# EAGLE design 8channelrelaydriver_throughole (EAGLE 7.2.0)
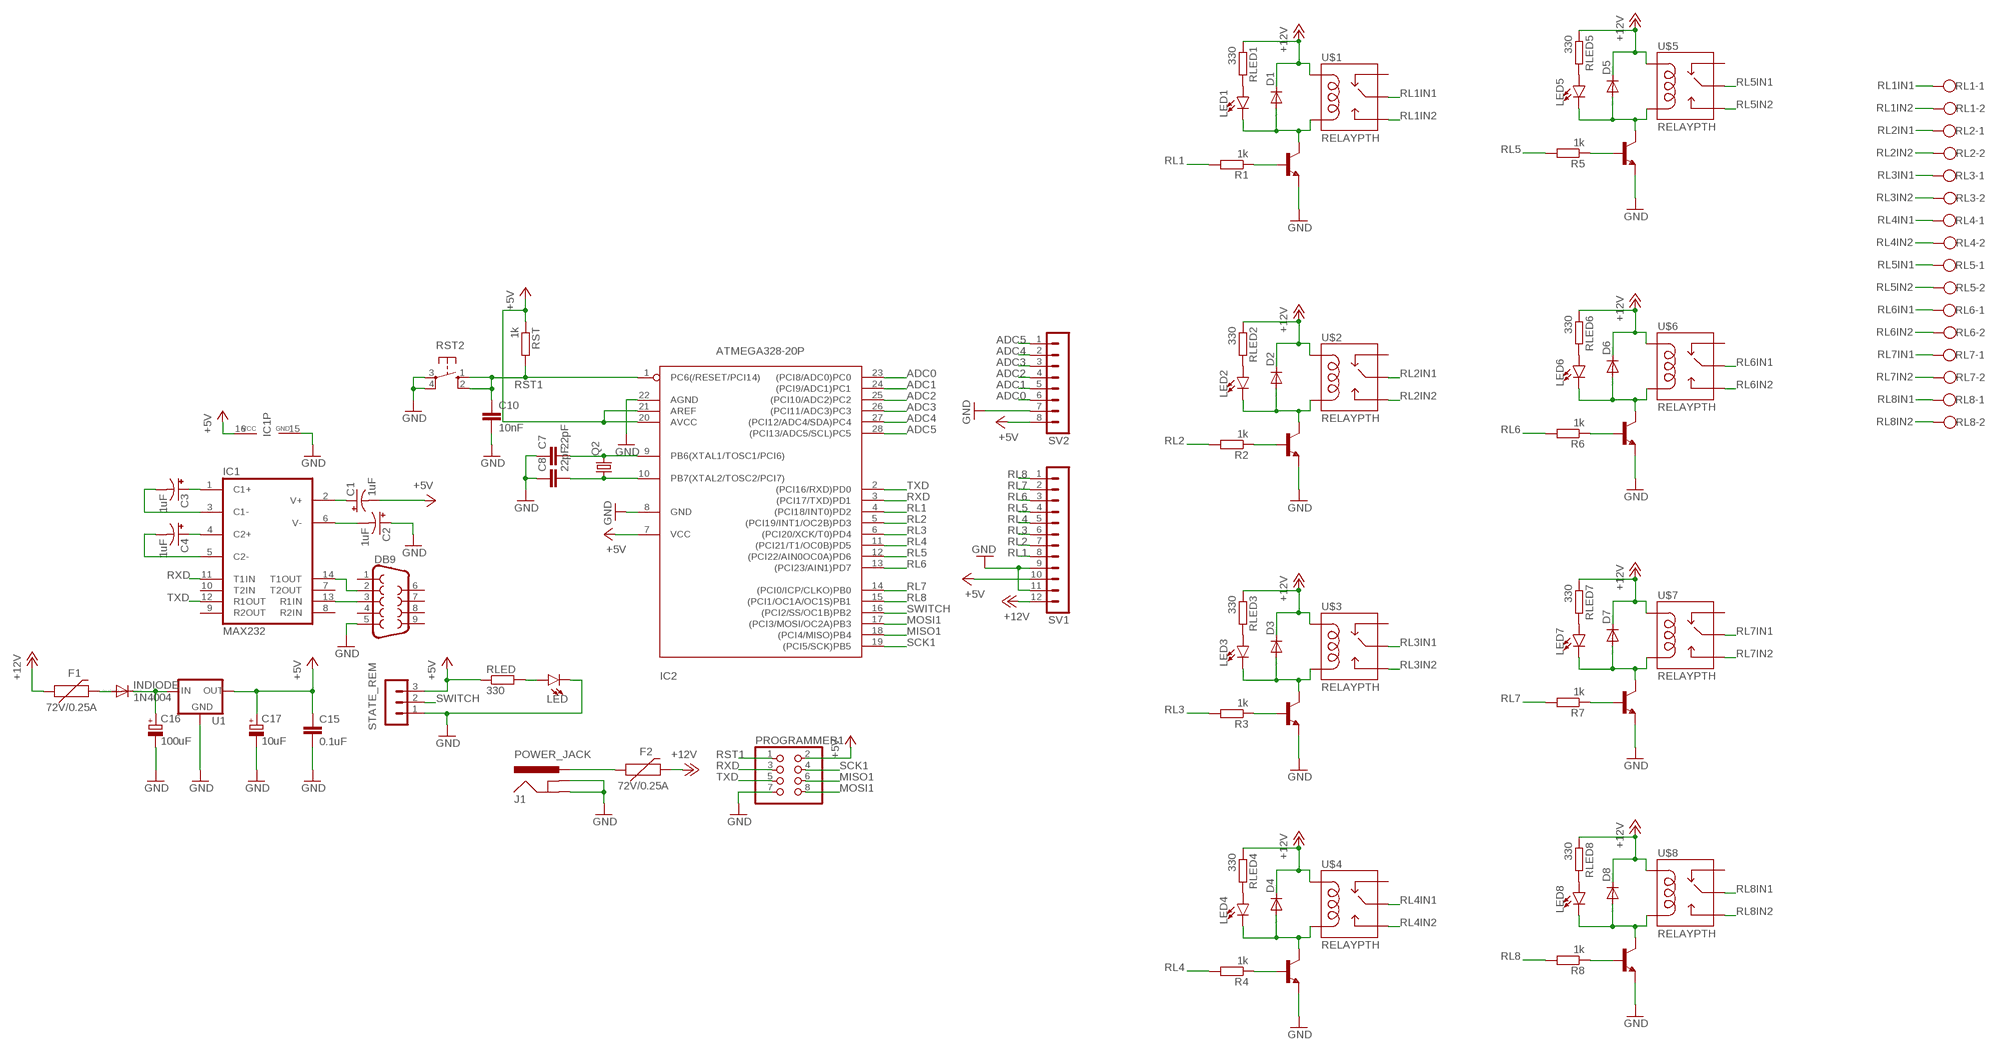
[diagram p0: schematic, sheet 1]

## Parts
C1  1uF  CPOL-USE2.5-6  [E2,5-6]
C2  1uF  CPOL-USE2.5-6  [E2,5-6]
C3  1uF  CPOL-USE2.5-6  [E2,5-6]
C4  1uF  CPOL-USE2.5-6  [E2,5-6]
C7  22pF  C-EU025-025X050  [C025-025X050]
C8  22pF  C-EU025-025X050  [C025-025X050]
C10  10nF  C-EU050-025X075  [C050-025X075]
C15  0.1uF  C-EU050-025X075  [C050-025X075]
C16  100uF  CPOL-EUE2.5-6  [E2,5-6]
C17  10uF  CPOL-EUE2.5-6  [E2,5-6]
D1  1N4004  [DO41-10]
D2  1N4004  [DO41-10]
D3  1N4004  [DO41-10]
D4  1N4004  [DO41-10]
D5  1N4004  [DO41-10]
D6  1N4004  [DO41-10]
D7  1N4004  [DO41-10]
D8  1N4004  [DO41-10]
DB9  DB9FEMALE  [DB9]
F1  72V/0.25A  PPTC_PTH  [PTH]
F2  72V/0.25A  PPTC_PTH  [PTH]
IC1  MAX232  [DIL16]
IC2  ATMEGA328-20P  [DIL28-3]
INDIODE  1N4004  [DO41-10]
J1  POWER_JACK  [POWER_JACK_PTH]
LED  LED5MM  [LED_5MM]
LED1  LED5MM  [LED_5MM]
LED2  LED5MM  [LED_5MM]
LED3  LED5MM  [LED_5MM]
LED4  LED5MM  [LED_5MM]
LED5  LED5MM  [LED_5MM]
LED6  LED5MM  [LED_5MM]
LED7  LED5MM  [LED_5MM]
LED8  LED5MM  [LED_5MM]
PROGRAMMER1  PINHD-2X4  [2X04]
Q2  CRYSTALHC49U70  [HC49U70]
R1  1k  R-EU_0207/10  [0207/10]
R2  1k  R-EU_0207/10  [0207/10]
R3  1k  R-EU_0207/10  [0207/10]
R4  1k  R-EU_0207/10  [0207/10]
R5  1k  R-EU_0207/10  [0207/10]
R6  1k  R-EU_0207/10  [0207/10]
R7  1k  R-EU_0207/10  [0207/10]
R8  1k  R-EU_0207/10  [0207/10]
RL1  W237-102  [W237-102]
RL2  W237-102  [W237-102]
RL3  W237-102  [W237-102]
RL4  W237-102  [W237-102]
RL5  W237-102  [W237-102]
RL6  W237-102  [W237-102]
RL7  W237-102  [W237-102]
RL8  W237-102  [W237-102]
RLED  330  R-EU_0207/10  [0207/10]
RLED1  330  R-EU_0207/10  [0207/10]
RLED2  330  R-EU_0207/10  [0207/10]
RLED3  330  R-EU_0207/10  [0207/10]
RLED4  330  R-EU_0207/10  [0207/10]
RLED5  330  R-EU_0207/10  [0207/10]
RLED6  330  R-EU_0207/10  [0207/10]
RLED7  330  R-EU_0207/10  [0207/10]
RLED8  330  R-EU_0207/10  [0207/10]
RST  1k  R-EU_0207/10  [0207/10]
RST2  10-XX  [B3F-10XX]
STATE_REM  MA03-1  [MA03-1]
SV1  MA12-1  [MA12-1]
SV2  MA08-1  [MA08-1]
T1  BC547  [TO92]
T2  BC547  [TO92]
T3  BC547  [TO92]
T4  BC547  [TO92]
T5  BC547  [TO92]
T6  BC547  [TO92]
T7  BC547  [TO92]
T8  BC547  [TO92]
U1  V_REG_78XXSIDE  [78XXL]
U$1  RELAYPTH  [SRD-05VDC-SL-C]
U$2  RELAYPTH  [SRD-05VDC-SL-C]
U$3  RELAYPTH  [SRD-05VDC-SL-C]
U$4  RELAYPTH  [SRD-05VDC-SL-C]
U$5  RELAYPTH  [SRD-05VDC-SL-C]
U$6  RELAYPTH  [SRD-05VDC-SL-C]
U$7  RELAYPTH  [SRD-05VDC-SL-C]
U$8  RELAYPTH  [SRD-05VDC-SL-C]

## Nets
+12V: D1.C D2.C D3.C D4.C D5.C D6.C D7.C D8.C F1.P$1 F2.P$2 RLED1.1 RLED2.1 RLED3.1 RLED4.1 RLED5.1 RLED6.1 RLED7.1 RLED8.1 SV1.12 U$1.COIL1 U$2.COIL1 U$3.COIL1 U$4.COIL1 U$5.COIL1 U$6.COIL1 U$7.COIL1 U$8.COIL1
ADC0: IC2.23((PCI8/ADC0)PC0) SV2.6
ADC1: IC2.24((PCI9/ADC1)PC1) SV2.5
ADC2: IC2.25((PCI10/ADC2)PC2) SV2.4
ADC3: IC2.26((PCI11/ADC3)PC3) SV2.3
ADC4: IC2.27((PCI12/ADC4/SDA)PC4) SV2.2
ADC5: IC2.28((PCI13/ADC5/SCL)PC5) SV2.1
MISO1: IC2.18((PCI4/MISO)PB4) PROGRAMMER1.6
MOSI1: IC2.17((PCI3/MOSI/OC2A)PB3) PROGRAMMER1.8
N$1: DB9.2 IC1.14(T1OUT)
N$2: LED.A RLED.2
N$3: C16.+ INDIODE.C U1.IN
N$4: D2.A LED2.K(C) T2.3(C) U$2.COIL0
N$5: D1.A LED1.K(C) T1.3(C) U$1.COIL0
N$6: R1.1 T1.2(B)
N$7: R2.1 T2.2(B)
N$8: D3.A LED3.K(C) T3.3(C) U$3.COIL0
N$9: R3.1 T3.2(B)
N$10: D4.A LED4.K(C) T4.3(C) U$4.COIL0
N$11: R4.1 T4.2(B)
N$12: D5.A LED5.K(C) T5.3(C) U$5.COIL0
N$13: R5.1 T5.2(B)
N$14: D6.A LED6.K(C) T6.3(C) U$6.COIL0
N$15: R6.1 T6.2(B)
N$16: D7.A LED7.K(C) T7.3(C) U$7.COIL0
N$17: R7.1 T7.2(B)
N$18: C1.+ IC1.2(V+)
N$19: D8.A LED8.K(C) T8.3(C) U$8.COIL0
N$20: C2.- IC1.6(V-)
N$21: C7.2 IC2.9(PB6(XTAL1/TOSC1/PCI6)) Q2.2
N$22: C8.2 IC2.10(PB7(XTAL2/TOSC2/PCI7)) Q2.1
N$23: C3.+ IC1.1(C1+)
N$24: C4.+ IC1.4(C2+)
N$25: C4.- IC1.5(C2-)
N$26: C3.- IC1.3(C1-)
N$27: R8.1 T8.2(B)
N$28: F1.P$2 INDIODE.A
N$29: LED1.A RLED1.2
N$30: F2.P$1 J1.PWR
N$32: LED2.A RLED2.2
N$34: LED3.A RLED3.2
N$36: LED4.A RLED4.2
N$38: LED5.A RLED5.2
N$40: LED6.A RLED6.2
N$42: LED7.A RLED7.2
N$44: LED8.A RLED8.2
PIN13: DB9.3 IC1.13(R1IN)
RL1: IC2.4((PCI18/INT0)PD2) R1.2 SV1.8
RL1IN1: RL1.1 U$1.SWCOMMON
RL1IN2: RL1.2 U$1.SWOPEN
RL2: IC2.5((PCI19/INT1/OC2B)PD3) R2.2 SV1.7
RL2IN1: RL2.1 U$2.SWCOMMON
RL2IN2: RL2.2 U$2.SWOPEN
RL3: IC2.6((PCI20/XCK/T0)PD4) R3.2 SV1.6
RL3IN1: RL3.1 U$3.SWCOMMON
RL3IN2: RL3.2 U$3.SWOPEN
RL4: IC2.11((PCI21/T1/OC0B)PD5) R4.2 SV1.5
RL4IN1: RL4.1 U$4.SWCOMMON
RL4IN2: RL4.2 U$4.SWOPEN
RL5: IC2.12((PCI22/AIN0OC0A)PD6) R5.2 SV1.4
RL5IN1: RL5.1 U$5.SWCOMMON
RL5IN2: RL5.2 U$5.SWOPEN
RL6: IC2.13((PCI23/AIN1)PD7) R6.2 SV1.3
RL6IN1: RL6.1 U$6.SWCOMMON
RL6IN2: RL6.2 U$6.SWOPEN
RL7: IC2.14((PCI0/ICP/CLKO)PB0) R7.2 SV1.2
RL7IN1: RL7.1 U$7.SWCOMMON
RL7IN2: RL7.2 U$7.SWOPEN
RL8: IC2.15((PCI1/OC1A/OC1S)PB1) R8.2 SV1.1
RL8IN1: RL8.1 U$8.SWCOMMON
RL8IN2: RL8.2 U$8.SWOPEN
RST1: C10.1 IC2.1(PC6(/RESET/PCI14)) PROGRAMMER1.1 RST2.1(S) RST2.2(S1) RST.2
RXD: IC1.11(T1IN) IC2.3((PCI17/TXD)PD1) PROGRAMMER1.3
SCK1: IC2.19((PCI5/SCK)PB5) PROGRAMMER1.4
SWITCH: IC2.16((PCI2/SS/OC1B)PB2) STATE_REM.2
TXD: IC1.12(R1OUT) IC2.2((PCI16/RXD)PD0) PROGRAMMER1.5
VDD: C1.- C15.1 C17.+ IC1.16(VCC) IC2.7(VCC) IC2.20(AVCC) IC2.21(AREF) PROGRAMMER1.2 RLED.1 RST.1 STATE_REM.3 SV1.10 SV2.8 U1.OUT ; supply symbol labelled +5V
VSS: C2.+ C7.1 C8.1 C10.2 C15.2 C16.- C17.- DB9.5 IC1.15(GND) IC2.8(GND) IC2.22(AGND) J1.GND J1.GNDBREAK LED.K(C) PROGRAMMER1.7 RST2.3(P) RST2.4(P1) STATE_REM.1 SV1.9 SV1.11 SV2.7 T1.1(E) T2.1(E) T3.1(E) T4.1(E) T5.1(E) T6.1(E) T7.1(E) T8.1(E) U1.GND ; supply symbol labelled GND
Unconnected: DB9.1 DB9.4 DB9.6 DB9.7 DB9.8 DB9.9 IC1.7(T2OUT) IC1.8(R2IN) IC1.9(R2OUT) IC1.10(T2IN) U$1.SWCLOSED(SWCLOSE) U$2.SWCLOSED(SWCLOSE) U$3.SWCLOSED(SWCLOSE) U$4.SWCLOSED(SWCLOSE) U$5.SWCLOSED(SWCLOSE) U$6.SWCLOSED(SWCLOSE) U$7.SWCLOSED(SWCLOSE) U$8.SWCLOSED(SWCLOSE)

## Library data of the parts
C1-C4 = rcl:CPOL-US: POLARIZED CAPACITOR, American symbol
C7 C8 C10 C15 = rcl:C-EU: CAPACITOR, European symbol
C16 C17 = rcl:CPOL-EU: POLARIZED CAPACITOR, European symbol
D1-D8 INDIODE = diode:1N4004: DIODE general purpose rectifier, 1 A
DB9 = SparkFun-Connectors:DB9: DB9 Connector Standard DB9 (D-Sub 9) serial connector. Can be used for CAN bus as well as RS485 and RS232. Footprint production proven. Here is the female version connector we sell at SparkFun: 9 Pin Female Serial Connector - PCB Mount <https://www.sparkfun.com/products/429> (PRT-00429) This connector has been used on the following SparkFun products: SparkFun RS232 Shifter - SMD <https://www.sparkfun.com/products/449> (PRT-00449) SparkFun RS232 Shifter SMD (No DB9) <https://www.sparkfun.com/products/8780> (PRT-08780); PROD_ID: CONN-08194
F1 F2 = SparkFun-Fuses:PPTC: Resettable Fuse PPTC Resettable Fuse. Really a sort of resistor with a polymeric positive temperature coefficient whose resistance increases dramatically with an increase in temperature. When heated by the power passing through the resistance rises causing the current to be limited, protecting the circuit. This is achieved by the transition of the polymer from a crystalline to an amorphous state where the conductive carbon separates breaking the conductive pathways found in the cool crystalline structure. When a PPTC cools back down it resumes conducting letting the circuit turn back on. SparkFun Products: SparkFun RedBoard - Programmed with Arduino <https://www.sparkfun.com/products/12757> Pro Micro - 5V/16MHz <https://www.sparkfun.com/products/12640> Arduino Pro 328 - 5V/16MHz <https://www.sparkfun.com/products/10915> MP3 Trigger <https://www.sparkfun.com/products/13720>; PROD_ID: RES-08490
IC1 = maxim:MAX232: RS232 TRANSCEIVER; MF: MAXIM; MPN: MAX232ACPE+; OC_FARNELL: 9723773; OC_NEWARK: 68K4544
IC2 = atmega328:ATMEGA328*P: MICROCONTROLLER 32 kBytes FLASH 2 kBytes SRAM 1 kBytes EEPROM USART 8-channel 10 bit ADC
J1 = SparkFun-Connectors:POWER_JACK: Power Jack Connector This is the standard 5.5mm barrel jack for power. The PTH is the most common, proven, reliable, footprint. The Slot footprint only works if the mill layer is transmitted to the PCB fab house so be warned. Here are the connectors we sell at SparkFun: DC Barrel Power Jack/Connector <https://www.sparkfun.com/products/119> (PRT-00119) DC Barrel Power Jack/Connector (SMD) <https://www.sparkfun.com/products/12748> (PRT-12748) DC Barrel Jack Adapter - Breadboard Compatible <https://www.sparkfun.com/products/10811> (PRT-10811) It is used on this SparkFun product (and many, many others): SparkFun RedBoard - Programmed with Arduino <https://www.sparkfun.com/products/12757> (DEV-12757) Also, if you need a mating power supply or connector, please check these out: Wall Adapter Power Supply - 9VDC 650mA <https://www.sparkfun.com/products/298> (TOL-00298) DC Barrel Jack Adapter - Male <https://www.sparkfun.com/products/10287> (PRT-10287); PROD_ID: CONN-08197
LED LED1-LED8 = SparkFun-LED:LED: LED (Generic) Standard schematic elements and footprints for 5mm, 3mm, 1206, and 0603 sized LEDs. Generic LEDs with no color specified.
PROGRAMMER1 = pinhead:PINHD-2X4: PIN HEADER
Q2 = crystal:CRYSTAL: CRYSTAL; OC_FARNELL: unknown; OC_NEWARK: unknown
R1-R8 RLED RLED1-RLED8 RST = resistor:R-EU_: RESISTOR, European symbol
RL1-RL8 = con-wago-500:W237-102: WAGO SCREW CLAMP; MPN: 237-102; OC_FARNELL: unknown; OC_NEWARK: 70K9898
RST2 = switch-omron:10-XX: OMRON SWITCH; MPN: B3F-1000; OC_FARNELL: 176432; OC_NEWARK: 36M3542
STATE_REM = con-lstb:MA03-1: PIN HEADER; OC_FARNELL: unknown; OC_NEWARK: unknown
SV1 = con-lstb:MA12-1: PIN HEADER; OC_FARNELL: unknown; OC_NEWARK: unknown
SV2 = con-lstb:MA08-1: PIN HEADER; OC_FARNELL: unknown; OC_NEWARK: unknown
T1-T8 = transistor-neu-to92:BC547: NPN TRANSISTOR
U1 = SparkFun-IC-Power:V_REG_78XX: Voltage Regulator Standard 78xx regulator. IGO (Input Ground Output). Spark Fun Electronics SKU : COM-00107
U$1-U$8 = SRD-05VDC-SL-C:RELAY: SPDT relay (COM-00101)

## Board
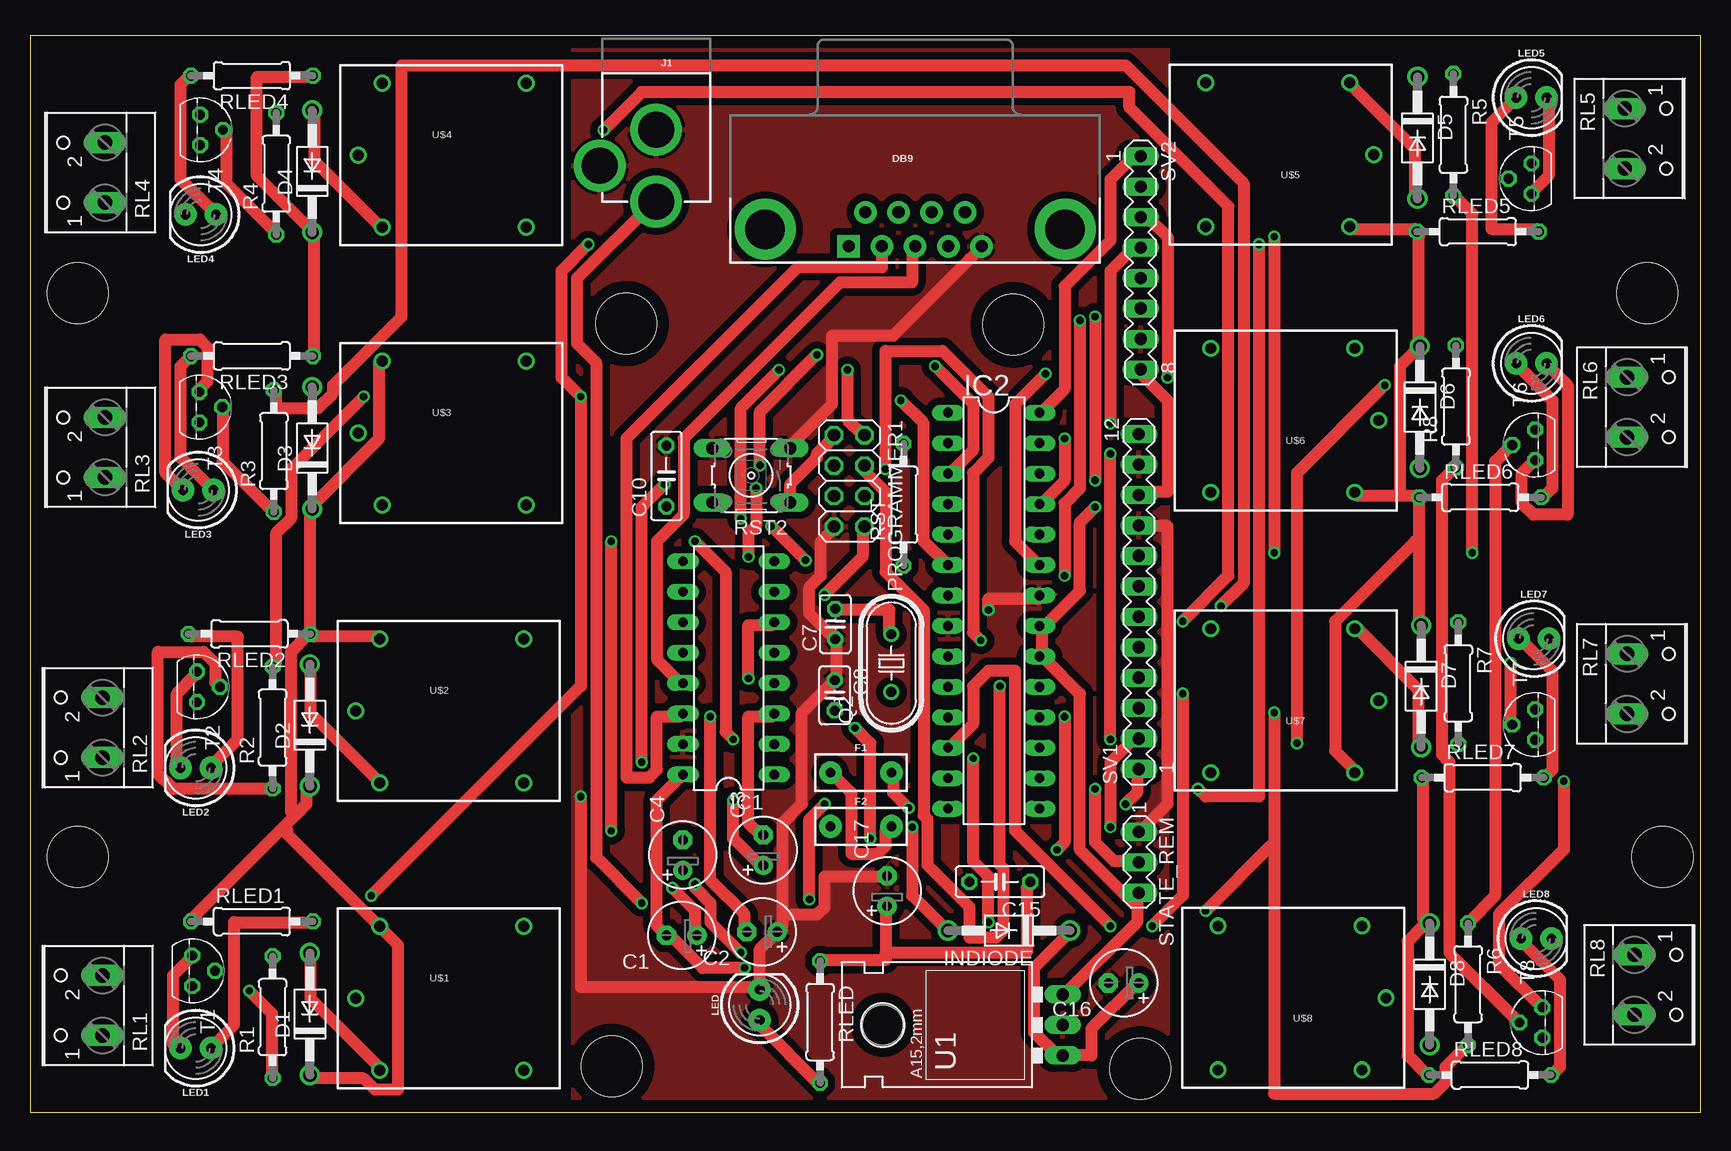
[diagram p1: board, top side]
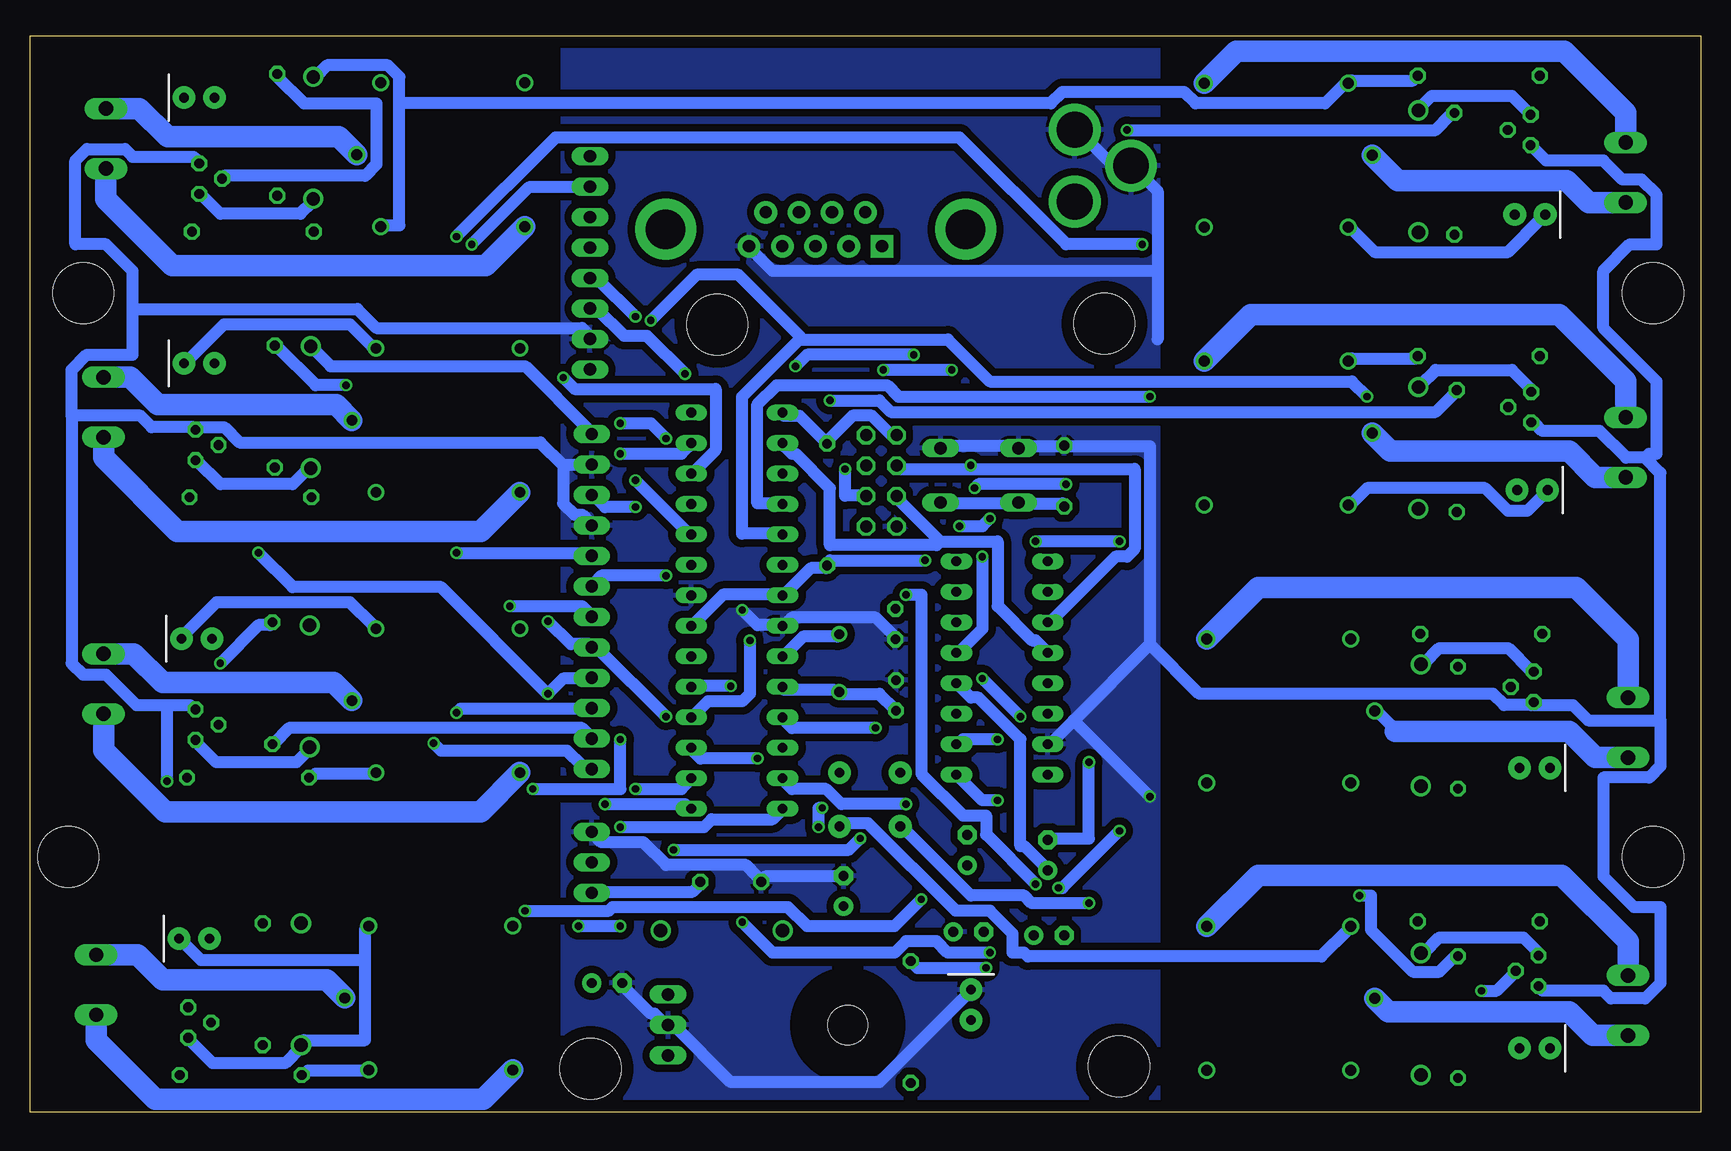
[diagram p2: board, bottom side, seen from below]

Size 139.22 x 89.74 mm. Coordinates in mm from the lower left corner, seen from the top.
Outline: 0,0 139.22,0 139.22,89.74 0,89.74 0,0
Copper layers (1*16): Top 0.035mm / dielectric 1.5mm / Bottom 0.035mm
Design rules "default *": minimum track width 40mil, minimum drill 24mil, track to track 8mil, track to pad 8mil, pad to pad 8mil, via to via 8mil, smd to smd 8mil, copper to edge 40mil, drill to drill 8mil, minimum pad ring 10mil, minimum via ring 8mil, stop-mask expansion 4mil, vias tented up to drill 0mil, thermal gap 10mil
Holes 5.08 mm at 49.69,65.75 81.95,65.64 92.51,3.62 48.47,3.82 3.97,68.29 3.97,21.3 136.05,21.3 134.78,68.29

### Footprints (pad centres in the part's own frame; a part is rotated, then mirrored left to right if it is on the bottom)
E2,5-6 = drill 0.813 pad 1.6: + -1.27,0 | drill 0.813 pad 1.6 octagon: - 1.27,0
C025-025X050 = drill 0.813 octagon: 1 -1.27,0; 2 1.27,0
C050-025X075 = drill 0.813 octagon: 1 -2.54,0; 2 2.54,0
DO41-10 = drill 1.118: A 5.08,0; C -5.08,0
DB9 = drill 1.016 pad 1.88 square: 1 -5.54,-1.42 | drill 1.016 pad 1.88: 2 -2.77,-1.42; 3 0,-1.42; 4 2.77,-1.42; 5 5.54,-1.42; 6 -4.15,1.42; 7 -1.38,1.42; 8 1.38,1.42; 9 4.15,1.42 | drill 3.302 pad 5.08: G1 -12.5,0; G2 12.5,0
PTH = drill 0.8 pad 1.88: P$1 -2.54,0; P$2 2.54,0
DIL16 = drill 0.813 long: 1 -8.89,-3.81; 2 -6.35,-3.81; 3 -3.81,-3.81; 4 -1.27,-3.81; 5 1.27,-3.81; 6 3.81,-3.81; 7 6.35,-3.81; 8 8.89,-3.81; 9 8.89,3.81; 10 6.35,3.81; 11 3.81,3.81; 12 1.27,3.81; 13 -1.27,3.81; 14 -3.81,3.81; 15 -6.35,3.81; 16 -8.89,3.81
DIL28-3 = drill 0.813 long: 1 -16.51,-3.81; 2 -13.97,-3.81; 3 -11.43,-3.81; 4 -8.89,-3.81; 5 -6.35,-3.81; 6 -3.81,-3.81; 7 -1.27,-3.81; 8 1.27,-3.81; 9 3.81,-3.81; 10 6.35,-3.81; 11 8.89,-3.81; 12 11.43,-3.81; 13 13.97,-3.81; 14 16.51,-3.81; 15 16.51,3.81; 16 13.97,3.81; 17 11.43,3.81; 18 8.89,3.81; 19 6.35,3.81; 20 3.81,3.81; 21 1.27,3.81; 22 -1.27,3.81; 23 -3.81,3.81; 24 -6.35,3.81; 25 -8.89,3.81; 26 -11.43,3.81; 27 -13.97,3.81; 28 -16.51,3.81
POWER_JACK_PTH = drill 2.997 pad 4.318: GND 0,7.7; GNDBREAK 4.7,10.7; PWR 0,13.7
LED_5MM = drill 0.813 pad 1.88: A -1.27,0; K 1.27,0
2X04 = drill 1.016 octagon: 1 -3.81,-1.27; 2 -3.81,1.27; 3 -1.27,-1.27; 4 -1.27,1.27; 5 1.27,-1.27; 6 1.27,1.27; 7 3.81,-1.27; 8 3.81,1.27
HC49U70 = drill 0.813: 1 -2.413,0; 2 2.413,0
0207/10 = drill 0.813 octagon: 1 -5.08,0; 2 5.08,0
W237-102 = drill 1.194 long: 1 -2.5,-1.27; 2 2.5,-1.27
B3F-10XX = drill 1.016 long: 1 -3.251,2.261; 2 3.251,2.261; 3 -3.251,-2.261; 4 3.251,-2.261
MA03-1 = drill 1.016 long: 1 -2.54,0; 2 0,0; 3 2.54,0
MA12-1 = drill 1.016 long: 1 -13.97,0; 2 -11.43,0; 3 -8.89,0; 4 -6.35,0; 5 -3.81,0; 6 -1.27,0; 7 1.27,0; 8 3.81,0; 9 6.35,0; 10 8.89,0; 11 11.43,0; 12 13.97,0
MA08-1 = drill 1.016 long: 1 -8.89,0; 2 -6.35,0; 3 -3.81,0; 4 -1.27,0; 5 1.27,0; 6 3.81,0; 7 6.35,0; 8 8.89,0
TO92 = drill 0.813 octagon: 1 1.27,0; 2 0,1.905; 3 -1.27,0
78XXL = drill 1.016 long: GND 0,-3.81; IN -2.54,-3.81; OUT 2.54,-3.81 | hole 3.302: 0,11.176
SRD-05VDC-SL-C = drill 0.9: COIL0 -5.39,-6.12; COIL1 -5.39,5.88; SWCLOSED 6.61,-6.12; SWCOMMON -7.39,-0.12; SWOPEN 6.61,5.88

### Placement (x,y rotation side)
C1  54.31,14.73 180 top
C2  61.01,15.04 180 top
C3  61.11,21.84 90 top
C4  54.41,21.44 90 top
C7  67.11,40.69 90 top
C8  67.06,34.75 270 top
C10  53.04,53.04 90 top
C15  80.82,19.2 180 top
C16  91.14,10.77 180 top
C17  71.42,18.44 90 top
D1  23.32,8.18 90 top
D2  23.32,32.26 90 top
D3  23.52,55.37 90 top
D4  23.52,78.44 90 top
D5  115.62,81.23 270 top
D6  115.82,58.78 270 top
D7  115.93,35.51 270 top
D8  116.64,10.67 270 top
DB9  73.76,73.61 0 top
F1  69.24,28.3 0 top
F2  69.24,23.83 0 top
IC1  58.22,37.03 90 top
IC2  80.31,41.81 270 top
INDIODE  81.58,15.14 180 top
J1  52.17,89.61 180 top
LED  60.81,8.94 90 top
LED1  13.82,5.33 180 top
LED2  13.82,28.7 180 top
LED3  14.02,51.87 180 top
LED4  14.22,74.83 180 top
LED5  125.12,84.58 0 top
LED6  125.12,62.43 0 top
LED7  125.32,39.47 0 top
LED8  125.53,14.48 0 top
PROGRAMMER1  68.28,52.63 270 top
Q2  71.78,37.44 90 top
R1  20.22,7.92 90 top
R2  20.22,32.05 90 top
R3  20.32,55.12 90 top
R4  20.52,78.23 90 top
R5  118.62,81.48 270 top
R6  119.84,10.67 270 top
R7  119.02,35.76 270 top
R8  118.82,58.83 90 top
RL1  4.78,8.89 90 top
RL2  4.78,32.05 90 top
RL3  4.98,55.42 90 top
RL4  4.98,78.33 90 top
RL5  134.16,81.18 270 top
RL6  134.37,58.78 270 top
RL7  134.37,35.71 270 top
RL8  134.98,10.62 270 top
RLED  65.84,7.52 270 top
RLED1  18.49,15.9 0 top
RLED2  18.29,39.88 180 top
RLED3  18.49,63.04 180 top
RLED4  18.49,86.41 180 top
RLED5  120.65,73.41 0 top
RLED6  120.85,51.26 0 top
RLED7  121.06,27.89 0 top
RLED8  121.67,3.1 0 top
RST  72.8,50.65 90 top
RST2  60.1,53.09 180 top
STATE_REM  92.41,20.83 270 top
SV1  92.41,42.57 90 top
SV2  92.56,70.82 270 top
T1  13.51,11.79 270 top
T2  13.92,35.46 270 top
T3  14.12,58.78 270 top
T4  14.17,81.89 270 top
T5  125.12,77.83 90 top
T6  125.43,55.63 90 top
T7  125.43,32.31 90 top
T8  126.03,7.47 90 top
U1  82.25,7.26 90 top
U$1  34.54,9.6 0 top
U$2  34.54,33.58 0 top
U$3  34.75,56.74 0 top
U$4  34.75,79.91 0 top
U$5  104.6,79.71 180 top
U$6  105,57.56 180 top
U$7  105,34.19 180 top
U$8  105.61,9.4 180 top

### Tracks (layer width: path | path; a pad name or v marks a point on that pad's centre or on a via)
+12V
  Top 1.016: RLED7.1 116.06,27.58 116.06,16.15 116.38,15.84 D8.C 116.06,15.52 114.8,14.25 114.8,4.72 116.38,3.14 RLED8.1 | U$5.COIL1 110.03,73.62 115.43,73.62 RLED5.1 115.75,72.99 115.75,64.1 D6.C 114.16,62.19 114.16,51.4 | 114.16,51.4 110.67,51.4 U$6.COIL1 | 114.16,51.4 115.75,51.4 RLED6.1 115.75,50.76 115.75,47.59 | 115.75,47.59 115.75,40.6 D7.C | U$7.COIL1 110.35,28.54 108.76,30.12 108.76,40.92 115.43,47.59 115.75,47.59 | RLED2.1 23.67,39.65 29.07,39.65 U$2.COIL1 | RLED2.1 23.35,40.28 23.35,50.13 D3.C 23.67,50.76 29.07,56.16 29.07,62.51 U$3.COIL1 | RLED3.1 23.67,63.14 23.67,73.3 D4.C 23.35,73.62 18.91,78.07 18.91,86.32 23.35,86.32 RLED4.1 | F2.P$2 71.62,23.77 71.3,23.46 71.3,22.19 70.66,21.55 68.44,21.55 68.44,26.63 66.85,28.22 F1.P$1 | 22.08,24.73 23.04,25.68 23.04,26.95 D2.C | 22.08,24.73 21.13,23.77 | 21.13,23.77 13.51,16.15 RLED1.1 | 21.13,23.77 21.45,23.46 21.45,23.14 29.07,15.52 U$1.COIL1 29.39,15.2 30.66,13.93 30.66,1.87 28.75,1.87 27.8,2.82 23.35,2.82 D1.C | RLED2.1 23.04,39.65 21.77,38.38 21.77,25.04 22.08,24.73
  Bottom 1.016: RLED8.1 116.38,3.14 116.06,3.45 111.3,3.45 U$8.COIL1 | RLED7.1 115.75,27.9 115.43,28.22 110.67,28.22 U$7.COIL1 | 108.44,84.1 108.44,73.94 109.72,73.94 U$5.COIL1 | 108.44,84.1 108.44,86.32 109.4,87.27 114.48,87.27 115.43,86.32 D5.C | D6.C 114.16,62.19 97.97,62.19 92.57,56.79 SV1.12 | RLED4.1 23.67,86.32 23.99,86 29.07,86 U$4.COIL1 29.71,85.69 31.29,84.1 42.09,84.1 43.04,85.05 53.2,85.05 54.15,84.1 108.44,84.1 | RLED3.1 23.67,62.83 29.07,62.83 U$3.COIL1 | F2.P$2 71.62,24.09 69.39,24.09 62.09,16.79 59.23,16.79 57.33,14.88 57.33,13.3 56.37,13.3 56.06,12.98 31.61,12.98 29.39,15.2 U$1.COIL1
ADC0  (via drill 0.61)
  Top 1.016: v84.63,61.56 82.09,59.02 82.09,47.59 84,45.68 IC2.23
  Bottom 1.016: v84.63,61.56 87.81,64.73 89.71,64.73 91.94,66.95 92.25,66.95 SV2.6
ADC1  (via drill 0.61)
  Top 1.016: v88.76,66.32 v88.76,52.67
  Bottom 1.016: v88.76,52.67 84.31,48.22 IC2.24 | v88.76,66.32 91.94,69.49 92.25,69.49 SV2.5
ADC2  (via drill 0.61)
  Top 1.016: v86.22,56.16 86.22,52.67 84.31,50.76 IC2.25 | v90.03,57.43 90.03,70.13 92.25,72.35 SV2.4
  Bottom 1.016: v86.22,56.16 87.49,57.43 v90.03,57.43
ADC3  (via drill 0.61)
  Top 1.016: v94.79,61.24 94.79,72.99 93.2,74.57 92.57,74.57 SV2.3
  Bottom 1.016: v94.79,61.24 93.84,60.29 82.09,60.29 82.09,55.21 84,53.3 IC2.26
ADC4  (via drill 0.61)
  Top 1.016: v90.03,31.08 v90.03,54.89 | v97.33,26.95 97.97,26.31 102.41,26.31 v102.41,72.35
  Bottom 1.016: v90.03,54.89 84.95,54.89 84.31,55.52 IC2.27 | v90.03,31.08 90.03,26.95 v97.33,26.95 | v102.41,72.35 97.65,77.11 92.57,77.11 SV2.2
ADC5
  Top 1.016: IC2.28 84.31,58.38 86.22,60.29 86.22,68.86 90.03,72.67 90.03,77.75 92.25,79.97 SV2.1
MISO1  (via drill 0.61)
  Top 1.016: v79.23,39.33 78.6,39.97 78.6,53.3 79.87,54.57 79.87,59.65 76.06,63.46 71.3,63.46 v71.3,53.62
  Bottom 1.016: v79.23,39.33 79.23,34.89 79.87,34.25 82.73,34.25 84,32.98 IC2.18 | v71.3,53.62 71.3,51.4 69.71,51.4 PROGRAMMER1.6
MOSI1  (via drill 0.61)
  Top 1.016: v78.6,29.49 78.6,20.92 79.87,19.65 v79.87,15.84 | v59.23,13.3 56.69,15.84 56.69,17.42 55.42,18.69 v55.42,19.01 | v66.22,43.14 69.39,46.32 69.39,48.54 PROGRAMMER1.8
  Bottom 1.016: v78.6,29.49 83.36,29.49 84,30.12 IC2.17 | v79.87,15.84 77.33,13.3 67.17,13.3 66.22,14.25 63.68,14.25 62.73,13.3 v59.23,13.3 | v55.42,19.01 59.55,23.14 59.55,24.73 61.46,24.73 64.95,28.22 64.95,43.14 v66.22,43.14
N$1
  Top 1.016: IC1.14 54.15,32.98 52.25,32.98 52.25,28.54 51.61,27.9 49.71,27.9 49.71,56.16 63.99,70.45 70.98,70.45 70.98,72.03 DB9.2
N$2
  Top 1.016: RLED.2 65.58,2.5 60.82,7.26 60.82,7.58 LED.A
N$3
  Top 1.016: C16.+ 92.25,10.76 88.44,6.95 88.44,4.72 U1.IN 85.58,4.72 83.68,6.63 83.68,12.03 86.54,14.88 INDIODE.C
N$4
  Top 1.016: T2.3 13.83,36.47 12.24,34.89 12.24,28.85 LED2.K | U$2.COIL0 29.07,27.58 23.35,33.3 23.35,37.11 D2.A
  Bottom 1.016: T2.3 14.15,36.79 16.05,38.7 21.77,38.7 23.04,37.43 D2.A
N$5
  Top 1.016: T1.3 13.51,12.98 11.93,11.39 11.93,5.68 12.24,5.36 LED1.K | U$1.COIL0 29.07,3.77 23.35,9.49 23.35,12.98 D1.A
  Bottom 1.016: T1.3 13.51,13.3 14.78,14.57 21.77,14.57 23.04,13.3 D1.A
N$6  (via drill 0.61)
  Top 1.016: v18.27,10.12 20.18,8.22 20.18,3.14 R1.1
  Bottom 1.016: v18.27,10.12 17.01,10.12 15.42,11.71 T1.2
N$7
  Top 1.016: T2.2 15.73,35.52 15.42,35.84 15.42,37.43 14.47,38.38 10.65,38.38 10.65,28.22 11.93,26.95 20.18,26.95 R2.1
N$8
  Top 1.016: T3.3 14.15,60.29 14.78,60.92 14.78,63.78 14.15,64.41 11.29,64.41 11.29,53.3 12.56,52.03 LED3.K
  Bottom 1.016: T3.3 14.15,60.29 15.73,61.87 22.08,61.87 23.35,60.6 D3.A | U$3.COIL0 29.07,50.76 27.8,52.03 17.96,52.03 16.05,50.13 14.47,50.13 12.88,51.71 LED3.K
N$9
  Top 1.016: R3.1 20.18,50.13 16.05,54.25 16.05,58.7 T3.2
N$10
  Top 1.016: U$4.COIL0 29.07,73.94 23.67,79.34 23.67,83.46 D4.A
  Bottom 1.016: T4.3 14.47,83.46 15.73,84.73 22.4,84.73 23.35,83.78 D4.A | LED4.K 13.19,74.57 16.05,71.72 27.17,71.72 29.07,73.62 U$4.COIL0
N$11
  Top 1.016: R4.1 20.5,73.3 16.37,77.43 16.37,81.88 T4.2
N$12
  Top 1.016: T5.3 125.27,76.8 126.54,78.07 126.54,84.42 LED5.K | U$5.COIL0 110.03,85.69 115.43,80.29 115.43,76.16 D5.A
  Bottom 1.016: T5.3 124.95,76.48 123.37,74.89 116.7,74.89 115.75,75.84 D5.A
N$13
  Bottom 1.016: T5.2 123.05,78.07 111.3,78.07 110.35,79.02 110.35,84.1 116.38,84.1 118.61,86.32 R5.1
N$14
  Top 1.016: T6.3 125.27,54.25 124.32,53.3 124.32,50.76 125.27,49.81 128.13,49.81 128.13,60.6 126.54,62.19 LED6.K
  Bottom 1.016: T6.3 125.27,54.25 123.37,52.35 117.34,52.35 116.06,53.62 D6.A | U$6.COIL0 110.67,63.78 112.57,65.68 123.05,65.68 126.22,62.51 LED6.K
N$15
  Top 1.016: R6.1 119.87,15.84 122.1,18.06 122.1,54.25 123.37,55.52 T6.2
N$16
  Top 1.016: U$7.COIL0 110.67,40.28 115.75,35.2 115.75,30.44 D7.A
  Bottom 1.016: T7.3 125.27,30.76 123.69,29.17 117.02,29.17 116.06,30.12 D7.A | LED7.K 126.54,39.65 123.69,42.51 112.57,42.51 110.67,40.6 U$7.COIL0
N$17  (via drill 0.61)
  Top 1.016: v123.37,37.43 123.37,32.35 T7.2
  Bottom 1.016: v123.37,37.43 120.19,40.6 119.24,40.6 R7.1
N$18  (via drill 0.61)
  Top 1.016: v58.6,31.08 57.96,31.71 57.96,45.05 v55.42,47.59 | v48.44,23.46 v48.44,47.59 | v53.52,18.69 55.42,16.79 55.42,14.88 C1.+
  Bottom 1.016: v58.6,31.08 61.46,31.08 61.77,30.76 IC1.2 | v48.44,47.59 v55.42,47.59 | v48.44,23.46 53.2,18.69 v53.52,18.69
N$19
  Bottom 1.016: T8.3 125.91,5.99 124,4.09 117.97,4.09 116.7,5.36 D8.A 116.38,5.99 111.3,5.99 111.3,12.66 | 111.3,12.66 111.3,15.2 U$8.COIL0 | 111.3,12.66 124.95,12.66 126.54,14.25 LED8.K
N$20  (via drill 0.61)
  Top 1.016: v59.87,36.16 59.87,40.6 61.77,40.6 IC1.6 | v56.69,32.98 56.69,19.33 59.55,16.47 59.55,15.2 C2.-
  Bottom 1.016: v56.69,32.98 v59.87,36.16
N$21
  Top 1.016: C7.2 67.17,41.87 71.62,41.87 71.62,39.97 Q2.2
  Bottom 1.016: IC2.9 76.38,38.06 74.79,39.65 71.93,39.65 Q2.2
N$22
  Bottom 1.016: C8.2 67.17,33.62 68.44,34.89 71.62,34.89 Q2.1 72.25,35.2 76.38,35.2 IC2.10
N$23  (via drill 0.61)
  Top 1.016: v58.6,26 58.6,22.82 60.82,20.6 C3.+
  Bottom 1.016: v58.6,26 59.87,26 61.77,27.9 IC1.1
N$24
  Bottom 1.016: IC1.4 61.77,35.52 60.82,34.57 60.18,34.57 56.69,31.08 56.69,22.19 56.37,22.19 54.47,20.28 C4.+
N$25  (via drill 0.61)
  Top 1.016: v59.87,46.32 59.87,48.22 60.5,48.86 v60.5,52.03 | v52.88,52.35 50.98,50.44 v50.98,29.17
  Bottom 1.016: v59.87,46.32 59.87,40.28 61.77,38.38 IC1.5 | v60.5,52.03 60.18,52.35 v52.88,52.35 | v50.98,29.17 50.98,22.82 54.15,22.82 C4.-
N$26
  Top 1.016: IC1.3 61.77,32.98 59.87,32.98 59.87,24.09 60.82,23.14 C3.-
N$27
  Top 1.016: T8.2 124,7.58 118.29,13.3 118.29,29.17 117.65,29.81 117.65,52.67 118.61,53.62 R8.1
N$28  (via drill 0.61)
  Top 1.016: v73.52,23.77 73.52,18.06 76.38,15.2 INDIODE.A | v73.2,25.36 71.93,26.63 71.93,28.22 F1.P$2
  Bottom 1.016: v73.52,23.77 73.52,25.36 v73.2,25.36
N$29
  Top 1.016: RLED1.2 23.35,15.84 17.01,15.84 17.01,7.26 15.1,5.36 LED1.A
N$30  (via drill 0.61)
  Top 1.016: v50.98,17.42 47.17,21.23 47.17,62.51 45.58,64.1 45.58,69.49 51.93,75.84 J1.PWR
  Bottom 1.016: v50.98,17.42 55.74,17.42 56.37,18.06 60.82,18.06 66.53,23.77 F2.P$1
N$32
  Top 1.016: RLED2.2 13.51,39.65 17.32,39.65 17.32,31.08 15.1,28.85 LED2.A
N$34
  Top 1.016: RLED3.2 12.56,62.19 12.56,54.57 15.1,52.03 LED3.A
N$36
  Top 1.016: RLED4.2 13.19,86.32 12.56,85.69 12.56,77.75 15.42,74.89 LED4.A
N$38
  Top 1.016: LED5.A 121.78,82.51 121.78,73.62 125.59,73.62 RLED5.2
N$40
  Top 1.016: RLED6.2 126.22,51.4 126.86,52.03 126.86,59.33 124,62.19 LED6.A
N$42
  Top 1.016: RLED7.2 126.22,27.9 126.86,28.54 126.86,36.79 124.32,39.33 LED7.A
N$44
  Top 1.016: RLED8.2 126.86,3.14 127.5,3.77 127.5,11.07 124.32,14.25 LED8.A
PIN13
  Top 1.016: IC1.13 54.15,35.84 52.25,37.74 52.25,47.59 54.47,49.81 54.47,56.16 67.49,69.18 73.52,69.18 73.52,72.03 DB9.3
RL1  (via drill 0.61)
  Top 1.016: v28.44,18.06 45.9,35.52 v45.9,59.65 44.31,61.24 44.31,70.13 v46.53,72.35 | v103.68,72.99 v103.68,46.63
  Bottom 1.016: v28.44,18.06 27.48,18.06 27.48,15.2 23.99,11.71 21.77,11.71 20.5,12.98 R1.2 | v45.9,59.65 66.85,59.65 67.8,60.6 77.01,60.6 78.6,59.02 78.6,50.76 76.69,50.76 IC2.4 | v103.68,46.63 92.57,46.63 SV1.8 | v103.68,72.99 95.43,81.24 61.77,81.24 52.88,72.35 v46.53,72.35
RL1IN1
  Bottom 1.778: RL1.1 8.98,6.39 10.97,8.38 26.05,8.38 U$1.SWCOMMON
RL1IN2
  Bottom 1.778: RL1.2 6.04,14.22 11.58,19.76 36.87,19.76 U$1.SWOPEN
RL2  (via drill 0.61)
  Top 1.016: v27.8,59.65 21.77,53.62 21.77,49.49 20.5,48.22 20.5,37.43 R2.2 | v86.22,44.73 86.22,50.76 87.49,52.03 v87.49,66
  Bottom 1.016: v27.8,59.65 29.07,60.92 59.23,60.92 62.73,64.41 75.11,64.41 | 75.11,64.41 79.87,59.65 79.87,48.22 76.69,48.22 IC2.5 | v86.22,44.73 91.62,44.73 92.25,44.09 SV1.7 | v87.49,66 83.68,69.81 80.19,69.81 75.11,64.73 75.11,64.41
RL2IN1
  Bottom 1.016: U$2.SWCOMMON 26.85,33.3 25.89,32.35 25.44,31.75
  Bottom 1.778: RL2.1 8.78,29.55 10.97,31.75 25.44,31.75
RL2IN2
  Bottom 1.778: RL2.2 6.04,39.42 10.36,43.74 36.87,43.74 U$2.SWOPEN
RL3  (via drill 0.61)
  Top 1.016: v72.57,59.33 74.47,57.43 74.47,47.59 76.38,45.68 IC2.6 | v99.24,42.19 101.14,44.09 101.14,77.43 91.3,87.27 30.98,87.27 30.98,66.32 25.26,60.6 25.26,59.97 23.99,58.7 20.5,58.7 20.5,59.97 R3.2
  Bottom 1.016: v72.57,59.33 68.44,59.33 67.49,58.38 22.08,58.38 20.5,59.97 R3.2 | v99.24,42.19 93.2,42.19 92.57,41.55 SV1.6
RL3IN1
  Bottom 1.778: RL3.1 8.78,52.92 10.97,55.12 25.85,55.12 U$3.SWCOMMON
RL3IN2
  Bottom 1.778: RL3.2 6.25,60.96 11.79,66.5 37.48,66.5 U$3.SWOPEN
RL4  (via drill 0.61)
  Top 1.016: v47.8,81.88 50.98,85.05 91.62,85.05 91.62,83.78 99.87,75.53 99.87,44.73 v96.06,40.92 | v68.76,32.03 70.03,30.76 v70.03,22.82 | v85.58,21.87 86.22,22.5 v86.22,32.98
  Bottom 1.016: v47.8,81.88 22.08,81.88 20.82,83.15 R4.2 | v96.06,40.92 94.16,39.01 92.57,39.01 SV1.5 91.94,38.7 v86.22,32.98 | v68.76,32.03 75.74,32.03 76.38,32.66 IC2.11 | v70.03,22.82 70.98,21.87 v85.58,21.87
RL4IN1
  Bottom 1.778: RL4.1 9.34,75.83 11.18,77.67 25.24,77.67 U$4.SWCOMMON
RL4IN2
  Bottom 1.778: RL4.2 6.25,83.31 11.38,88.44 38.7,88.44 U$4.SWOPEN
RL5  (via drill 0.61)
  Top 1.016: v90.03,15.52 82.09,23.46 82.09,36.79 79.87,36.79 78.6,35.52 78.6,32.35 76.69,30.44 IC2.12 | v93.52,15.52 96.06,18.06 v96.06,34.89 | v120.19,46.63 120.19,74.89 118.92,76.16 R5.2
  Bottom 1.016: v93.52,15.52 v90.03,15.52 | SV1.4 92.57,36.16 94.79,36.16 v96.06,34.89 104.95,43.78 117.34,43.78 v120.19,46.63
RL5IN1
  Bottom 1.778: RL5.1 130.11,83.68 127.76,81.33 113.49,81.33 U$5.SWCOMMON
RL5IN2
  Bottom 1.778: RL5.2 132.89,76.1 127.36,70.56 101.25,70.56 U$5.SWOPEN
RL6  (via drill 0.61)
  Top 1.016: v103.68,33.3 103.68,22.19 | 103.68,22.19 103.68,1.55 117.02,1.55 117.97,2.5 117.97,3.77 119.56,5.36 R6.2 | v66.22,25.68 64.95,24.41 v64.95,17.74 | v97.97,16.79 103.37,22.19 103.68,22.19
  Bottom 1.016: v103.68,33.3 103.37,33.62 92.57,33.62 SV1.3 | v66.22,25.68 71.62,25.68 72.89,26.95 75.74,26.95 76.38,27.58 IC2.13 | v64.95,17.74 67.17,15.52 74.47,15.52 76.06,17.11 90.66,17.11 90.98,16.79 v97.97,16.79
RL6IN1
  Bottom 1.778: RL6.1 130.87,61.28 128.57,58.98 113.7,58.98 U$6.SWCOMMON
RL6IN2
  Bottom 1.778: RL6.2 133.1,54.56 126.95,48.41 101.66,48.41 U$6.SWOPEN
RL7  (via drill 0.61)
  Top 1.016: v90.03,23.77 90.03,29.17 92.25,31.39 SV1.2
  Bottom 1.016: v90.03,23.77 83.05,23.77 82.41,24.41 77.33,24.41 76.69,25.04 IC2.14 | R7.2 118.92,30.76 117.65,32.03 93.2,32.03 92.57,31.39 SV1.2
RL7IN1
  Bottom 1.778: RL7.1 130.57,38.21 128.17,35.81 113.9,35.81 U$7.SWCOMMON
RL7IN2
  Bottom 1.778: RL7.2 133.1,30.18 127.96,25.04 101.66,25.04 U$7.SWOPEN
RL8  (via drill 0.61)
  Top 1.016: v91.3,25.68 92.25,26.63 92.25,28.54 SV1.1 | v112.89,60.6 105.59,53.3 v105.59,30.76
  Bottom 1.016: v91.3,25.68 84.63,25.68 84.31,25.36 IC2.15 | v112.89,60.6 115.43,60.6 118.61,63.78 R8.2 | v105.59,30.76 104.95,30.12 94.48,30.12 93.2,28.85 92.57,28.85 SV1.1
RL8IN1
  Bottom 1.778: RL8.1 130.26,13.12 128.17,11.02 114.51,11.02 U$8.SWCOMMON
RL8IN2
  Bottom 1.778: RL8.2 133.71,5.99 128.78,1.07 101.45,1.07 U$8.SWOPEN
RST1
  Top 1.016: PROGRAMMER1.1 66.85,56.16 65.58,54.89 65.58,54.57 63.36,52.35 63.36,51.08 RST2.1
  Bottom 1.016: IC2.1 76.38,58.06 75.11,58.06 72.89,55.84 RST.2 72.57,56.16 70.66,58.06 69.08,58.06 67.49,56.48 67.17,56.48 PROGRAMMER1.1 | C10.1 53.2,50.76 56.69,50.76 RST2.2 57.33,50.76 63.04,50.76 RST2.1
RXD  (via drill 0.61)
  Top 1.016: v75.42,62.19 78.6,59.02 78.6,55.21 76.69,53.3 IC2.3 | v65.58,63.14 60.82,58.38 v60.82,53.94
  Bottom 1.016: 60.82,53.62 66.85,53.62 PROGRAMMER1.3 | 60.82,53.62 47.17,53.62 47.17,46.95 47.8,46.32 48.76,46.32 54.15,40.92 IC1.11 | v75.42,62.19 74.47,63.14 v65.58,63.14 | v60.82,53.94 60.82,53.62
SCK1  (via drill 0.61)
  Top 1.016: v80.82,35.52 80.82,20.6 81.14,20.28 81.14,15.2 80.51,14.57 78.28,14.57 78.28,17.11 74.79,20.6 74.79,24.41 74.47,24.73 74.47,41.87 71.3,45.05 71.3,51.71 69.71,53.3 69.71,53.62 PROGRAMMER1.4
  Bottom 1.016: v80.82,35.52 84,35.52 IC2.19
SWITCH  (via drill 0.61)
  Top 1.016: v88.76,26.95 88.76,22.5 90.35,20.92 92.25,20.92 STATE_REM.2
  Bottom 1.016: v88.76,26.95 84.95,26.95 84.31,27.58 IC2.16
TXD
  Bottom 1.016: 63.36,47.59 58.6,47.59 58.6,42.19 55.74,39.33 55.42,39.33 54.47,38.38 IC1.12 | 63.36,47.59 66.85,51.08 PROGRAMMER1.5 | IC2.2 76.38,55.52 75.74,54.89 75.42,54.89 72.57,52.03 72.57,47.27 63.68,47.27 63.36,47.59
VDD  (via drill 0.61)
  Top 1.016: SV1.10 92.57,51.71 94.79,51.71 94.79,59.33 92.57,61.56 92.57,61.87 SV2.8 | v68.12,61.87 68.12,57.75 69.39,56.48 PROGRAMMER1.2 | v62.41,61.87 59.23,58.7 v59.23,49.49 | v64.63,46 v61.77,48.86 | v88.76,50.44 87.49,49.17 87.49,43.46 84.63,40.6 IC2.21 84.31,40.28 84.31,38.06 IC2.20 84.63,37.74 87.49,34.89 87.49,21.87 91.94,17.42 92.25,17.42 | IC1.16 54.15,27.9 52.25,26 52.25,15.52 C1.- 53.52,14.57 56.06,12.03 v59.55,12.03 | 71.3,13.3 71.3,17.11 C17.+ | 71.3,13.3 71.3,12.66 65.9,12.66 RLED.1 | 92.25,17.42 92.25,18.06 STATE_REM.3 | 92.25,17.42 92.25,15.84 86.22,9.8 U1.OUT | 71.3,13.3 83.05,13.3 83.05,18.69 83.36,19.01 C15.1
  Bottom 1.016: v62.41,61.87 v68.12,61.87 | v59.23,49.49 59.87,48.86 v61.77,48.86 | v64.63,46 72.57,46 RST.1 72.89,45.36 74.15,45.36 76.38,43.14 IC2.7 77.01,43.14 81.46,43.14 84,40.6 IC2.21 | v88.76,50.44 91.3,50.44 92.25,51.4 SV1.10 | C15.1 83.36,19.01 84,18.38 92.25,18.38 STATE_REM.3 | v59.55,12.03 65.26,12.03 RLED.1
VSS  (via drill 0.61)
  Top 1.016: SV1.9 92.57,48.86 94.79,48.86 94.79,25.68 92.57,23.46 STATE_REM.1 | v79.87,41.87 79.87,42.82 84,42.82 IC2.22 | PROGRAMMER1.7 66.85,48.54 65.9,47.59 65.9,44.73 64.95,43.78 64.95,41.55 66.85,39.65 C7.1 67.17,39.33 67.17,36.16 C8.1 66.85,35.84 64.31,33.3 64.31,25.68 62.73,24.09 62.73,16.47 | 62.73,16.47 62.73,15.2 C2.+ 62.09,14.88 60.82,13.61 60.82,10.44 LED.K 60.5,10.44 45.9,10.44 v45.9,26.31 | 62.73,16.47 65.58,16.47 66.22,17.11 66.22,19.65 71.3,19.65 C17.- | v127.81,27.58 127.81,21.87 122.42,16.47 122.42,12.34 125.91,8.85 T8.1 | DB9.5 79.23,72.03 71.93,64.73 66.85,64.73 66.85,59.02 63.36,55.52 RST2.3
  Bottom 1.016: 45.26,70.13 45.26,76.8 47.17,78.7 J1.GNDBREAK 47.8,79.02 49.07,79.02 51.93,81.88 J1.GND | 45.26,70.13 45.26,64.41 | 94.79,53.94 94.79,50.76 93.84,49.81 93.2,49.81 92.57,49.17 SV1.9 | 94.79,53.94 92.57,53.94 SV1.11 | C17.- 71.62,19.65 77.96,19.65 78.28,19.33 C15.2 78.6,19.65 79.55,20.6 86.22,20.6 88.12,22.5 91.62,22.5 92.25,23.14 STATE_REM.1 | C7.1 67.17,39.65 68.76,41.24 75.74,41.24 76.38,40.6 IC2.8 77.01,40.6 78.6,40.6 v79.87,41.87 | C16.- 90.03,10.76 87.49,8.22 87.17,8.22 86.22,7.26 U1.GND 85.58,7.26 80.82,2.5 68.44,2.5 60.82,10.12 LED.K | 127.81,33.93 130.35,33.93 132.89,36.47 134.8,36.47 135.75,37.43 135.75,58.06 | 127.81,33.93 125.91,33.93 125.59,33.62 T7.1 | 135.75,58.06 130.03,58.06 129.08,57.11 125.59,57.11 T6.1 124.95,57.11 123.05,57.11 121.78,55.84 96.7,55.84 94.79,53.94 | 130.67,66.95 130.67,63.14 134.48,63.14 135.75,61.87 135.75,58.06 | 130.67,66.95 130.67,70.13 132.89,72.35 135.43,72.35 135.43,79.34 134.48,80.29 131.31,80.29 130.67,79.65 125.59,79.65 125.27,79.34 T5.1 | 127.81,33.93 v127.81,27.58 | 130.67,66.95 111.94,66.95 110.35,65.37 93.2,65.37 92.57,64.73 SV2.7 | 45.26,70.13 77.33,70.13 79.23,72.03 DB9.5 | 45.9,39.01 52.25,32.66 | 52.25,32.66 54.15,30.76 IC1.15 | 45.9,39.01 45.9,55.52 52.57,55.52 C10.2 53.2,55.52 56.69,55.52 RST2.4 57.33,55.52 63.04,55.52 RST2.3 | 3.35,32.66 3.35,28.85 4.3,27.9 8.12,27.9 8.12,19.65 5.58,17.11 3.35,17.11 3.35,10.76 4.62,9.49 7.48,9.49 8.12,10.12 13.19,10.12 13.51,10.44 T1.1 | 3.35,32.66 9.38,32.66 10.65,33.93 13.83,33.93 T2.1 14.15,33.93 16.37,33.93 17.32,34.89 41.77,34.89 45.9,39.01
  Bottom 1.016: 4.62,54.57 6.21,54.57 8.43,56.79 13.19,56.79 13.83,57.43 T3.1 | 4.62,54.57 3.35,53.3 3.35,32.66 | T4.1 14.15,80.61 12.88,79.34 8.12,79.34 6.53,77.75 4.94,77.75 3.67,76.48 3.67,72.35 5.89,72.35 8.12,70.13 8.12,65.37 3.67,60.92 3.67,54.89 4.3,54.89 4.62,54.57 | 52.25,32.66 v45.9,26.31
  pour Top (isolate 0.61): 45.26,89.81 45.26,-0.36 94.79,-0.36 94.79,89.81
  pour Bottom (isolate 0.61): 45.26,89.81 45.26,-0.36 94.79,-0.36 94.79,89.81